# EAGLE design ABIMC Board (EAGLE 9.5.2)
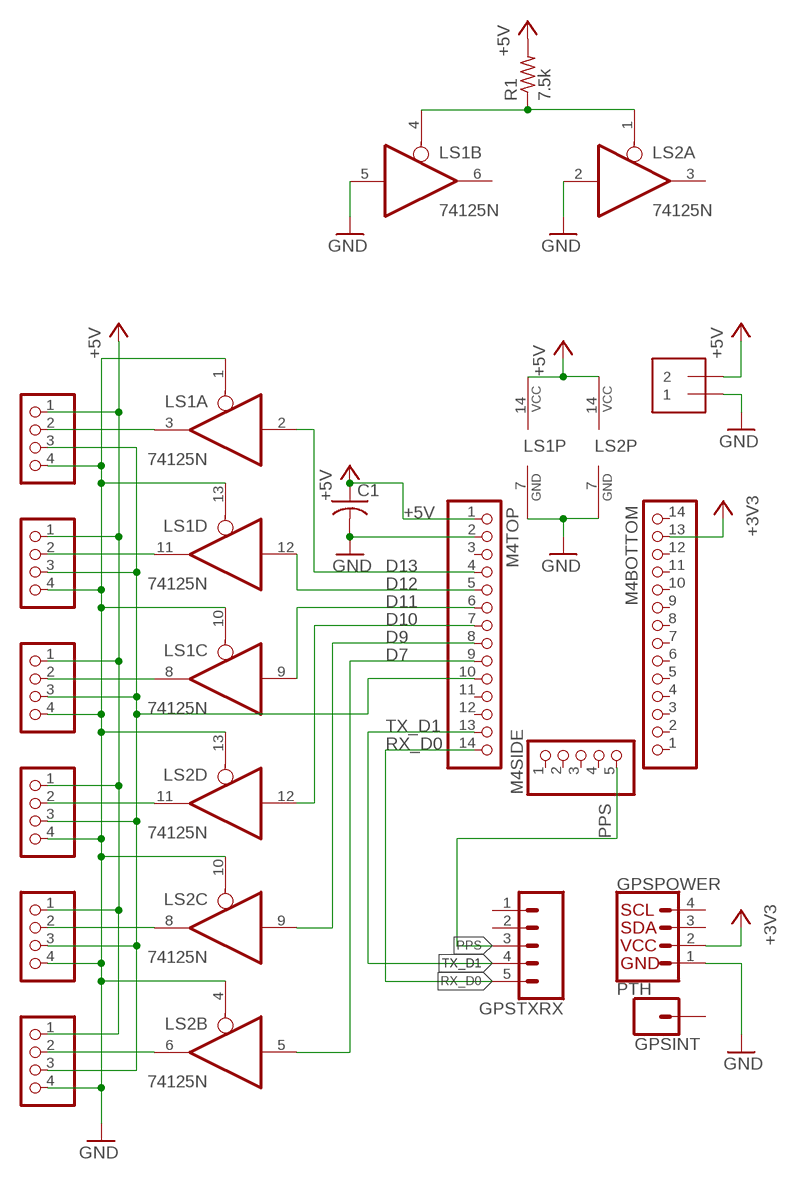
[diagram p0: schematic, sheet 1]

## Parts
C1  C-US050-024X044  [C050-024X044]
GPSINT  CONN_01PTH_NO_SILK_YES_STOP  [1X01_NO_SILK]
GPSPOWER  PTH  I2C_STANDARD_NO_SILK  [1X04_NO_SILK]
GPSTXRX  CONN_05NO_SILK  [1X05_NO_SILK]
JP1  PINHD-1X4/90  [1X04/90]
JP2  PINHD-1X4/90  [1X04/90]
JP3  PINHD-1X4/90  [1X04/90]
JP4  PINHD-1X4/90  [1X04/90]
JP5  PINHD-1X4/90  [1X04/90]
JP6  PINHD-1X4/90  [1X04/90]
LS1  74125N  [DIL14]
LS2  74125N  [DIL14]
M4BOTTOM  HEADER-1X14  [1X14_ROUND70]
M4SIDE  HEADER-1X570MIL  [1X05_ROUND_70]
M4TOP  HEADER-1X14  [1X14_ROUND70]
POWER  1X2-3.5MM  [1X2-3.5MM]
R1  7.5k  R-US_0204/7  [0204/7]

## Nets
+3V3: GPSPOWER.2(VCC) M4BOTTOM.13
+5V: C1.1 JP1.1 JP2.1 JP3.1 JP4.1 JP5.1 JP6.1 LS1.14(P:VCC) LS2.14(P:VCC) M4TOP.1 POWER.2 R1.2
D7: LS2.5(B:I) M4TOP.9
D9: LS2.9(C:I) M4TOP.8
D10: LS2.12(D:I) M4TOP.7
D11: LS1.9(C:I) M4TOP.6
D12: LS1.12(D:I) M4TOP.5
D13: LS1.2(A:I) M4TOP.4
DSDATA: JP1.3 JP2.3 JP3.3 JP4.3 JP5.3 JP6.3 M4TOP.10
GND: C1.2 GPSPOWER.1(GND) JP1.4 JP2.4 JP3.4 JP4.4 JP5.4 JP6.4 LS1.1(A:OE) LS1.5(B:I) LS1.7(P:GND) LS1.10(C:OE) LS1.13(D:OE) LS2.2(A:I) LS2.4(B:OE) LS2.7(P:GND) LS2.10(C:OE) LS2.13(D:OE) M4TOP.2 POWER.1
N$1: JP1.2 LS1.3(A:O)
N$2: JP2.2 LS1.11(D:O)
N$3: JP4.2 LS2.11(D:O)
N$4: JP5.2 LS2.8(C:O)
N$5: JP6.2 LS2.6(B:O)
N$6: JP3.2 LS1.8(C:O)
PPS: GPSTXRX.3 M4SIDE.5
RX_D0: GPSTXRX.5 M4TOP.14
TX_D1: GPSTXRX.4 M4TOP.13
VHI: LS1.4(B:OE) LS2.1(A:OE) R1.1
Unconnected: GPSINT.1 GPSPOWER.3(SDA) GPSPOWER.4(SCL) GPSTXRX.1 GPSTXRX.2 LS1.6(B:O) LS2.3(A:O) M4BOTTOM.1 M4BOTTOM.2 M4BOTTOM.3 M4BOTTOM.4 M4BOTTOM.5 M4BOTTOM.6 M4BOTTOM.7 M4BOTTOM.8 M4BOTTOM.9 M4BOTTOM.10 M4BOTTOM.11 M4BOTTOM.12 M4BOTTOM.14 M4SIDE.1 M4SIDE.2 M4SIDE.3 M4SIDE.4 M4TOP.3 M4TOP.11 M4TOP.12

## Library data of the parts
C1 = adafruit:C-US: CAPACITOR, American symbol
GPSINT = SparkFun-Connectors:CONN_01: Single connection point. Often used as Generic Header-pin footprint for 0.1 inch spaced/style header connections On any of the 0.1 inch spaced packages, you can populate with these: Break Away Headers - Straight <https://www.sparkfun.com/products/116> (PRT-00116) Break Away Male Headers - Right Angle <https://www.sparkfun.com/products/553> (PRT-00553) Female Headers <https://www.sparkfun.com/products/115> (PRT-00115) Break Away Headers - Machine Pin <https://www.sparkfun.com/products/117> (PRT-00117) Break Away Female Headers - Swiss Machine Pin <https://www.sparkfun.com/products/743> (PRT-00743) This device is also useful as a general connection point to wire up your design to another part of your project. Our various solder wires solder well into these plated through hole pads. Hook-Up Wire - Assortment (Stranded, 22 AWG) <https://www.sparkfun.com/products/11375> (PRT-11375) Hook-Up Wire - Assortment (Solid Core, 22 AWG) <https://www.sparkfun.com/products/11367> (PRT-11367) View the entire wire category on our website here <https://www.sparkfun.com/categories/141> Special notes: SMTSO-256-ET is a "flush mount" nut for a 4-40 screw. We mostly use this on specialty testbeds; it is a nice way to connect hardware to your PCB at an adjustable hieght. Also note, the SNAP packages are for using a snappable style connector. We sell a baggie of snaps and they are also used on two LilyPad designs: Snap Assortment - 30 pack (male and female) <https://www.sparkfun.com/products/11347> (DEV-11347) LilyPad Arduino SimpleSnap <https://www.sparkfun.com/products/10941> (DEV-10941) LilyPad SimpleSnap Protoboard <https://www.sparkfun.com/products/10940> (DEV-10940); SPICEPREFIX: X
GPSPOWER = SparkX:I2C_STANDARD: SparkFun I2C Standard Pinout Header SparkFun has standardized on a pinout for all I2C based sensor breakouts. This pinout allows I2C boards to be plugged directly into the headers on Arduino Uno compatible boards, and to be daisy chained easily. Example SparkFun Products: SparkFun Atmospheric Sensor Breakout - BME280 <https://www.sparkfun.com/products/13676> SparkFun Altitude/Pressure Sensor Breakout - MPL3115A2 <https://www.sparkfun.com/products/11084> SparkFun TOF Range Finder Sensor - VL6180 <https://www.sparkfun.com/products/12785>; SPICEPREFIX: E
GPSTXRX = SparkFun-Connectors:CONN_05: Multi connection point. Often used as Generic Header-pin footprint for 0.1 inch spaced/style header connections On any of the 0.1 inch spaced packages, you can populate with these: Break Away Headers - Straight <https://www.sparkfun.com/products/116> (PRT-00116) Break Away Male Headers - Right Angle <https://www.sparkfun.com/products/553> (PRT-00553) Female Headers <https://www.sparkfun.com/products/115> (PRT-00115) Break Away Headers - Machine Pin <https://www.sparkfun.com/products/117> (PRT-00117) Break Away Female Headers - Swiss Machine Pin <https://www.sparkfun.com/products/743> (PRT-00743) For SCREWTERMINALS and SPRING TERMINALS visit here: Screw Terimnals on SparkFun.com <https://www.sparkfun.com/search/results?term=Screw+Terminals> (5mm/3.5mm/2.54mm spacing) This device is also useful as a general connection point to wire up your design to another part of your project. Our various solder wires solder well into these plated through hole pads. Hook-Up Wire - Assortment (Stranded, 22 AWG) <https://www.sparkfun.com/products/11375> (PRT-11375) Hook-Up Wire - Assortment (Solid Core, 22 AWG) <https://www.sparkfun.com/products/11367> (PRT-11367) View the entire wire category on our website here <https://www.sparkfun.com/categories/141> Special notes: Molex polarized connector foot print use with SKU : PRT-08231 with associated crimp pins and housings. 1MM SMD Version SKU: PRT-10208; SPICEPREFIX: X
JP1-JP6 = pinhead:PINHD-1X4: PIN HEADER
LS1 LS2 = adafruit:74*125: Quad bus BUFFER, 3-state
M4BOTTOM M4TOP = microbuilder:HEADER-1X14; SPICEPREFIX: X
M4SIDE = microbuilder:HEADER-1X5: PIN HEADER; SPICEPREFIX: X
POWER = adafruit:1X2: 3.5mm Terminal block http://www.ladyada.net/library/pcb/eaglelibrary.html; SPICEPREFIX: B
R1 = adafruit:R-US_: RESISTOR, American symbol

## Board
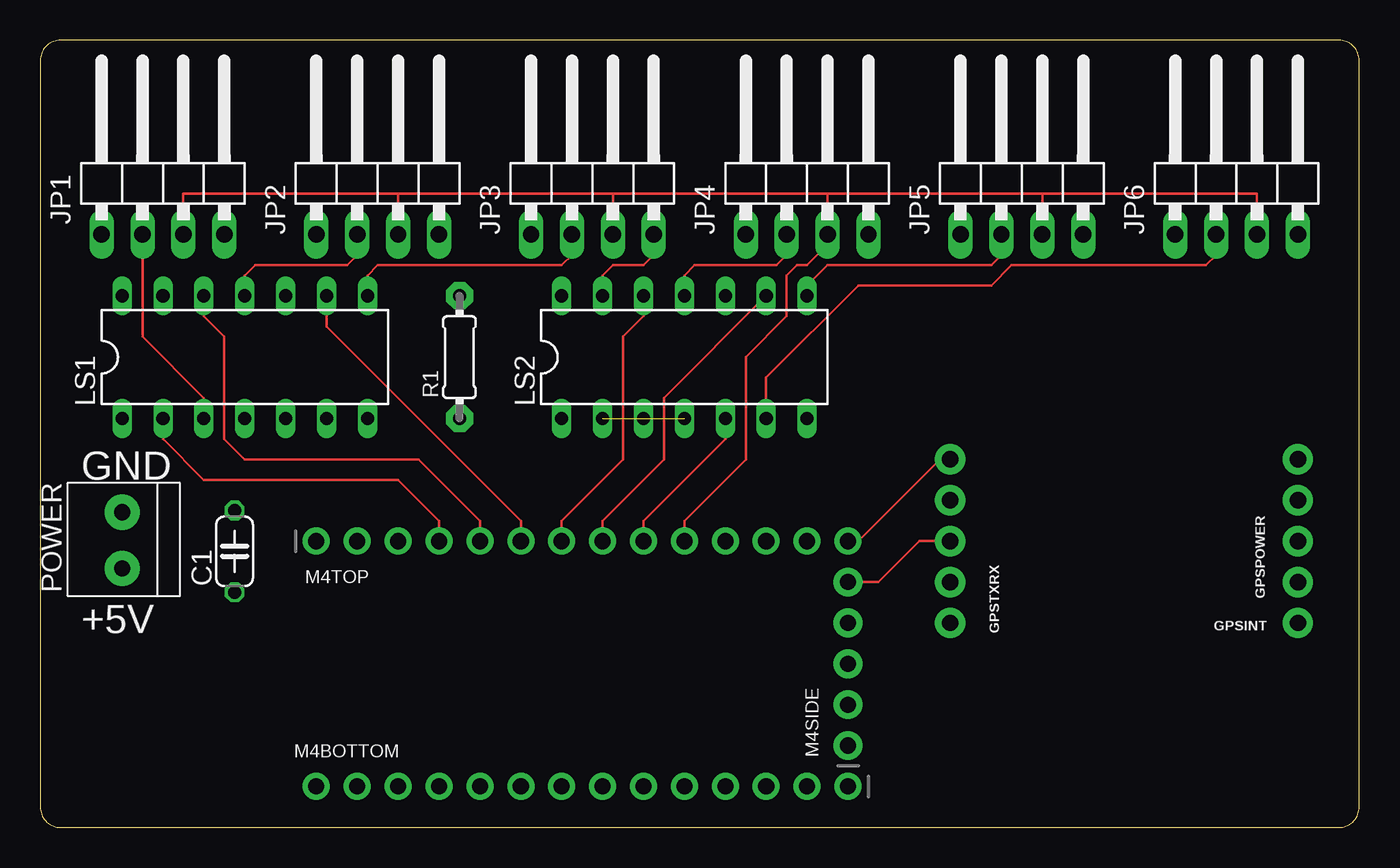
[diagram p1: board, top side]
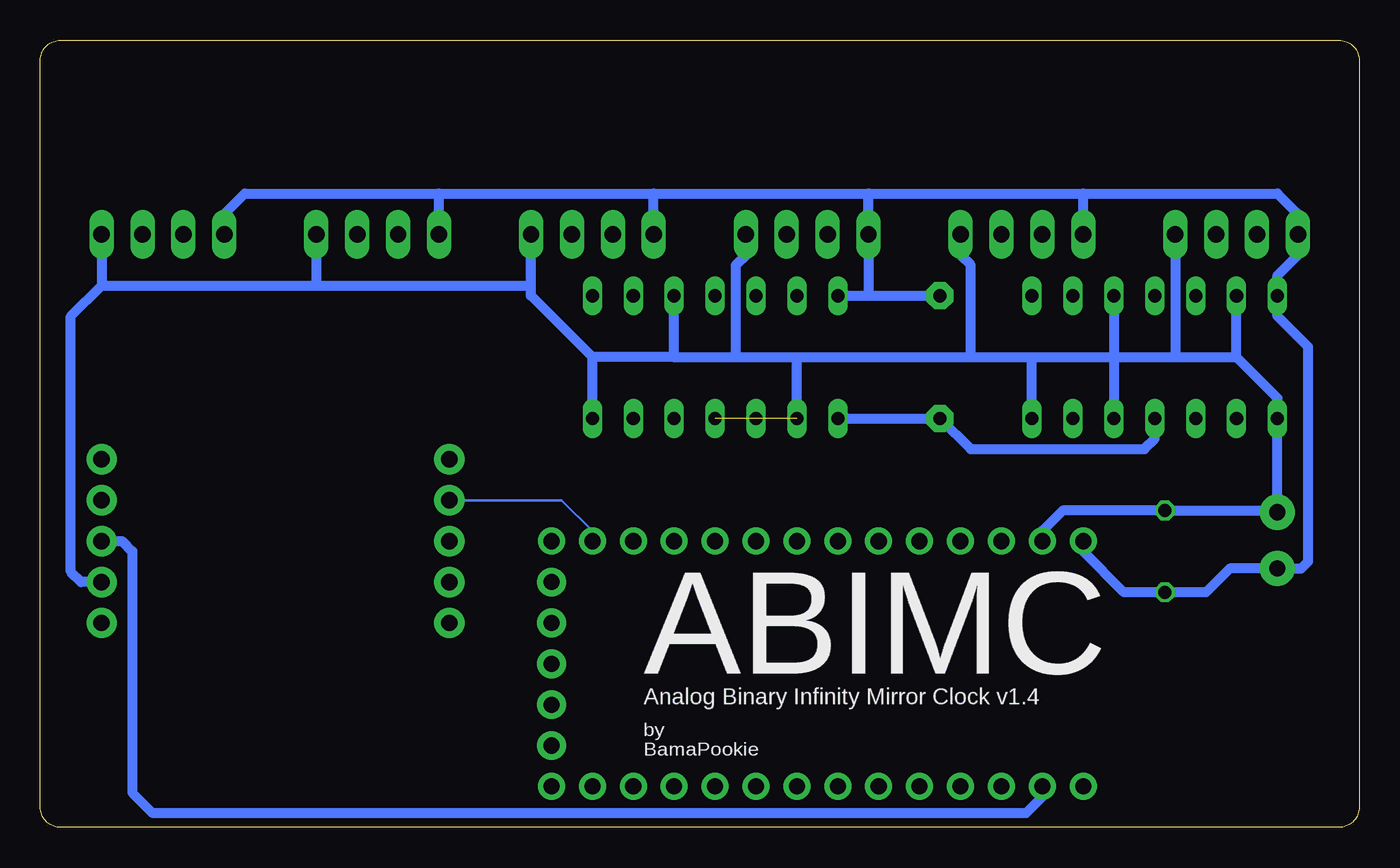
[diagram p2: board, bottom side, seen from below]

Size 81.92 x 48.9 mm. Coordinates in mm from the lower left corner, seen from the top.
Outline: 0,47.62 0,1.27 arc90 1.27,0 80.64,0 arc90 81.92,1.27 81.92,47.62 arc90 80.64,48.9 1.27,48.9 arc90 0,47.62
Copper layers (1*16): Top 0.035559375mm / dielectric 1.6mm / Bottom 0.035559375mm
Design rules "oshpark-2layer": minimum track width 6mil, minimum drill 10mil, track to track 6mil, track to pad 6mil, pad to pad 6mil, via to via 6mil, smd to smd 6mil, copper to edge 15mil, drill to drill 6mil, minimum pad ring 5mil, minimum via ring 5mil, stop-mask expansion 2.5mil, vias tented up to drill 0mil, thermal gap 10mil

### Footprints (pad centres in the part's own frame; a part is rotated, then mirrored left to right if it is on the bottom)
C050-024X044 = drill 0.813 octagon: 1 -2.54,0; 2 2.54,0
1X01_NO_SILK = drill 1.016 pad 1.88: 1 0,0
1X04_NO_SILK = drill 1.016 pad 1.88: 1 0,0; 2 2.54,0; 3 5.08,0; 4 7.62,0
1X05_NO_SILK = drill 1.016 pad 1.88: 1 0,0; 2 2.54,0; 3 5.08,0; 4 7.62,0; 5 10.16,0
1X04/90 = drill 1.016 long: 1 -3.81,-3.81; 2 -1.27,-3.81; 3 1.27,-3.81; 4 3.81,-3.81
DIL14 = drill 0.813 long: 1 -7.62,-3.81; 2 -5.08,-3.81; 3 -2.54,-3.81; 4 0,-3.81; 5 2.54,-3.81; 6 5.08,-3.81; 7 7.62,-3.81; 8 7.62,3.81; 9 5.08,3.81; 10 2.54,3.81; 11 0,3.81; 12 -2.54,3.81; 13 -5.08,3.81; 14 -7.62,3.81
1X14_ROUND70 = drill 1 pad 1.676: 1 -16.51,0; 2 -13.97,0; 3 -11.43,0; 4 -8.89,0; 5 -6.35,0; 6 -3.81,0; 7 -1.27,0; 8 1.27,0; 9 3.81,0; 10 6.35,0; 11 8.89,0; 12 11.43,0; 13 13.97,0; 14 16.51,0
1X05_ROUND_70 = drill 1 pad 1.778: 1 -5.08,0; 2 -2.54,0; 3 0,0; 4 2.54,0; 5 5.08,0
1X2-3.5MM = drill 1 pad 2.184: 1 1.8,0; 2 -1.7,0
0204/7 = drill 0.813 pad 1.676 octagon: 1 -3.81,0; 2 3.81,0

### Placement (x,y rotation side)
C1  12.06,17.14 90 top
GPSINT  78.11,12.7 90 top
GPSPOWER  78.11,15.24 90 top
GPSTXRX  56.52,12.7 90 top
JP1  7.62,40.64 0 top
JP2  20.95,40.64 0 top
JP3  34.29,40.64 0 top
JP4  47.62,40.64 0 top
JP5  60.96,40.64 0 top
JP6  74.3,40.64 0 top
LS1  12.7,29.21 0 top
LS2  40.01,29.21 0 top
M4BOTTOM  33.66,2.54 180 top
M4SIDE  50.16,10.16 90 top
M4TOP  33.66,17.78 0 top
POWER  5.08,17.78 90 top
R1  26.04,29.21 90 top

### Tracks (layer width: path | path; a pad name or v marks a point on that pad's centre or on a via)
+3V3
  Bottom 0.61: M4BOTTOM.13 19.68,1.91 20.7,0.89 74.93,0.89 76.2,2.16 76.2,17.14 76.83,17.78 GPSPOWER.2
+5V
  Bottom 0.61: 17.14,39.37 5.08,39.37 3.81,38.1 JP1.1 3.81,35.56 5.08,34.29 LS1.14 5.08,31.75 3.17,29.84 3.17,16.51 3.6,16.08 POWER.2 8.05,16.08 9.53,14.61 C1.1 14.61,14.61 17.14,17.14 M4TOP.1 | 30.48,39.37 17.14,39.37 | 30.48,39.37 JP3.1 30.48,33.02 | JP5.1 57.15,39.37 | 57.15,39.37 43.81,39.37 | 43.81,39.37 30.48,39.37 | JP6.1 70.48,38.1 69.22,39.37 57.15,39.37 | JP2.1 17.14,39.37 | LS2.14 30.48,33.02 | 30.48,33.02 R1.2 | JP4.1 43.81,39.37
D7
  Top 0.152: M4TOP.9 37.47,19.05 42.55,24.13 LS2.5
D9
  Top 0.152: M4TOP.8 34.92,19.05 38.73,22.86 38.73,26.67 LS2.9
D10
  Top 0.152: M4TOP.7 32.38,19.05 36.2,22.86 36.2,30.48 37.47,31.75 LS2.12
D11
  Top 0.152: LS1.9 17.78,31.11 29.84,19.05 M4TOP.6
D12
  Top 0.152: M4TOP.5 27.3,19.05 23.5,22.86 12.7,22.86 11.43,24.13 11.43,30.48 10.16,31.75 LS1.12
D13
  Top 0.152: LS1.2 7.62,24.13 10.16,21.59 22.23,21.59 24.77,19.05 M4TOP.4
DSDATA
  Top 0.152: JP6.3 75.56,39.37 62.23,39.37 | 62.23,39.37 JP5.3 | 62.23,39.37 48.9,39.37 | 48.9,39.37 JP4.3 48.9,36.2 47.62,34.92 46.99,34.92 46.35,34.29 46.35,31.75 43.81,29.21 43.81,22.86 40.01,19.05 M4TOP.10 | 48.9,39.37 35.56,39.37 | 35.56,39.37 JP3.3 | 35.56,39.37 22.23,39.37 | 22.23,39.37 JP2.3 | 22.23,39.37 8.89,39.37 JP1.3
GND  (1 unrouted)
  Top 0.152: JP3.4 38.1,35.56 37.47,34.92 35.56,34.92 34.92,34.29 LS2.13
  Bottom 0.61: 38.73,29.21 38.73,34.92 38.1,35.56 JP3.4 | 34.92,29.21 24.13,29.21 | 24.13,29.21 20.32,29.21 | 15.24,29.21 11.43,29.21 | 11.43,29.21 7.62,29.21 | 38.73,29.21 34.92,29.21 | 42.55,29.21 47.62,29.21 | 42.55,29.21 38.73,29.21 | 7.62,29.21 5.08,26.67 LS1.1 POWER.1 5.08,19.68 C1.2 18.41,19.68 19.68,18.41 M4TOP.2 | 20.32,29.21 15.24,29.21 | LS1.7 20.32,29.21 | LS2.7 47.62,29.21 | JP5.4 64.77,33.66 | GPSPOWER.1 79.38,15.24 80.01,15.88 80.01,31.75 78.11,33.66 | LS2.2 34.92,29.21 | 78.11,33.66 64.77,33.66 | 24.13,29.21 24.13,34.92 24.77,35.56 JP2.4 | 15.24,29.21 LS1.5 | 42.55,29.21 LS2.10 | 47.62,29.21 51.44,33.02 51.44,33.66 | 64.77,33.66 51.44,33.66 | 7.62,29.21 LS1.13 | JP1.4 11.43,29.21 | 51.44,33.66 JP4.4 | JP6.4 78.11,33.66 | LS1.10 15.24,29.21
N$1
  Top 0.152: LS1.3 10.16,26.67 6.35,30.48 JP1.2
N$2
  Top 0.152: LS1.11 12.7,34.29 13.34,34.92 19.05,34.92 19.68,35.56 JP2.2
N$3
  Top 0.152: JP4.2 46.35,35.56 45.72,34.92 40.64,34.92 40.01,34.29 LS2.11
N$4
  Top 0.152: JP5.2 59.69,35.56 59.05,34.92 48.9,34.92 47.62,33.66 LS2.8
N$5
  Top 0.152: JP6.2 73.03,35.56 72.39,34.92 60.33,34.92 59.05,33.66 50.8,33.66 45.09,27.94 LS2.6
N$6
  Top 0.152: LS1.8 20.32,34.29 20.95,34.92 32.38,34.92 33.02,35.56 JP3.2
PPS
  Top 0.152: GPSTXRX.3 54.61,17.78 52.07,15.24 M4SIDE.5
RX_D0
  Top 0.152: GPSTXRX.5 55.88,22.86 50.8,17.78 M4TOP.14
TX_D1
  Bottom 0.152: M4TOP.13 47.62,18.41 49.53,20.32 GPSTXRX.4
VHI
  Bottom 0.61: LS2.1 R1.1 24.13,23.5 13.34,23.5 12.7,24.13 LS1.4

### Text on the board
tPlace: GND | +5V
bPlace: ABIMC | Analog Binary Infinity Mirror Clock v1.4 | by / BamaPookie